# EAGLE design HAP-12xBusverteiler-1.0 (EAGLE 6.4)
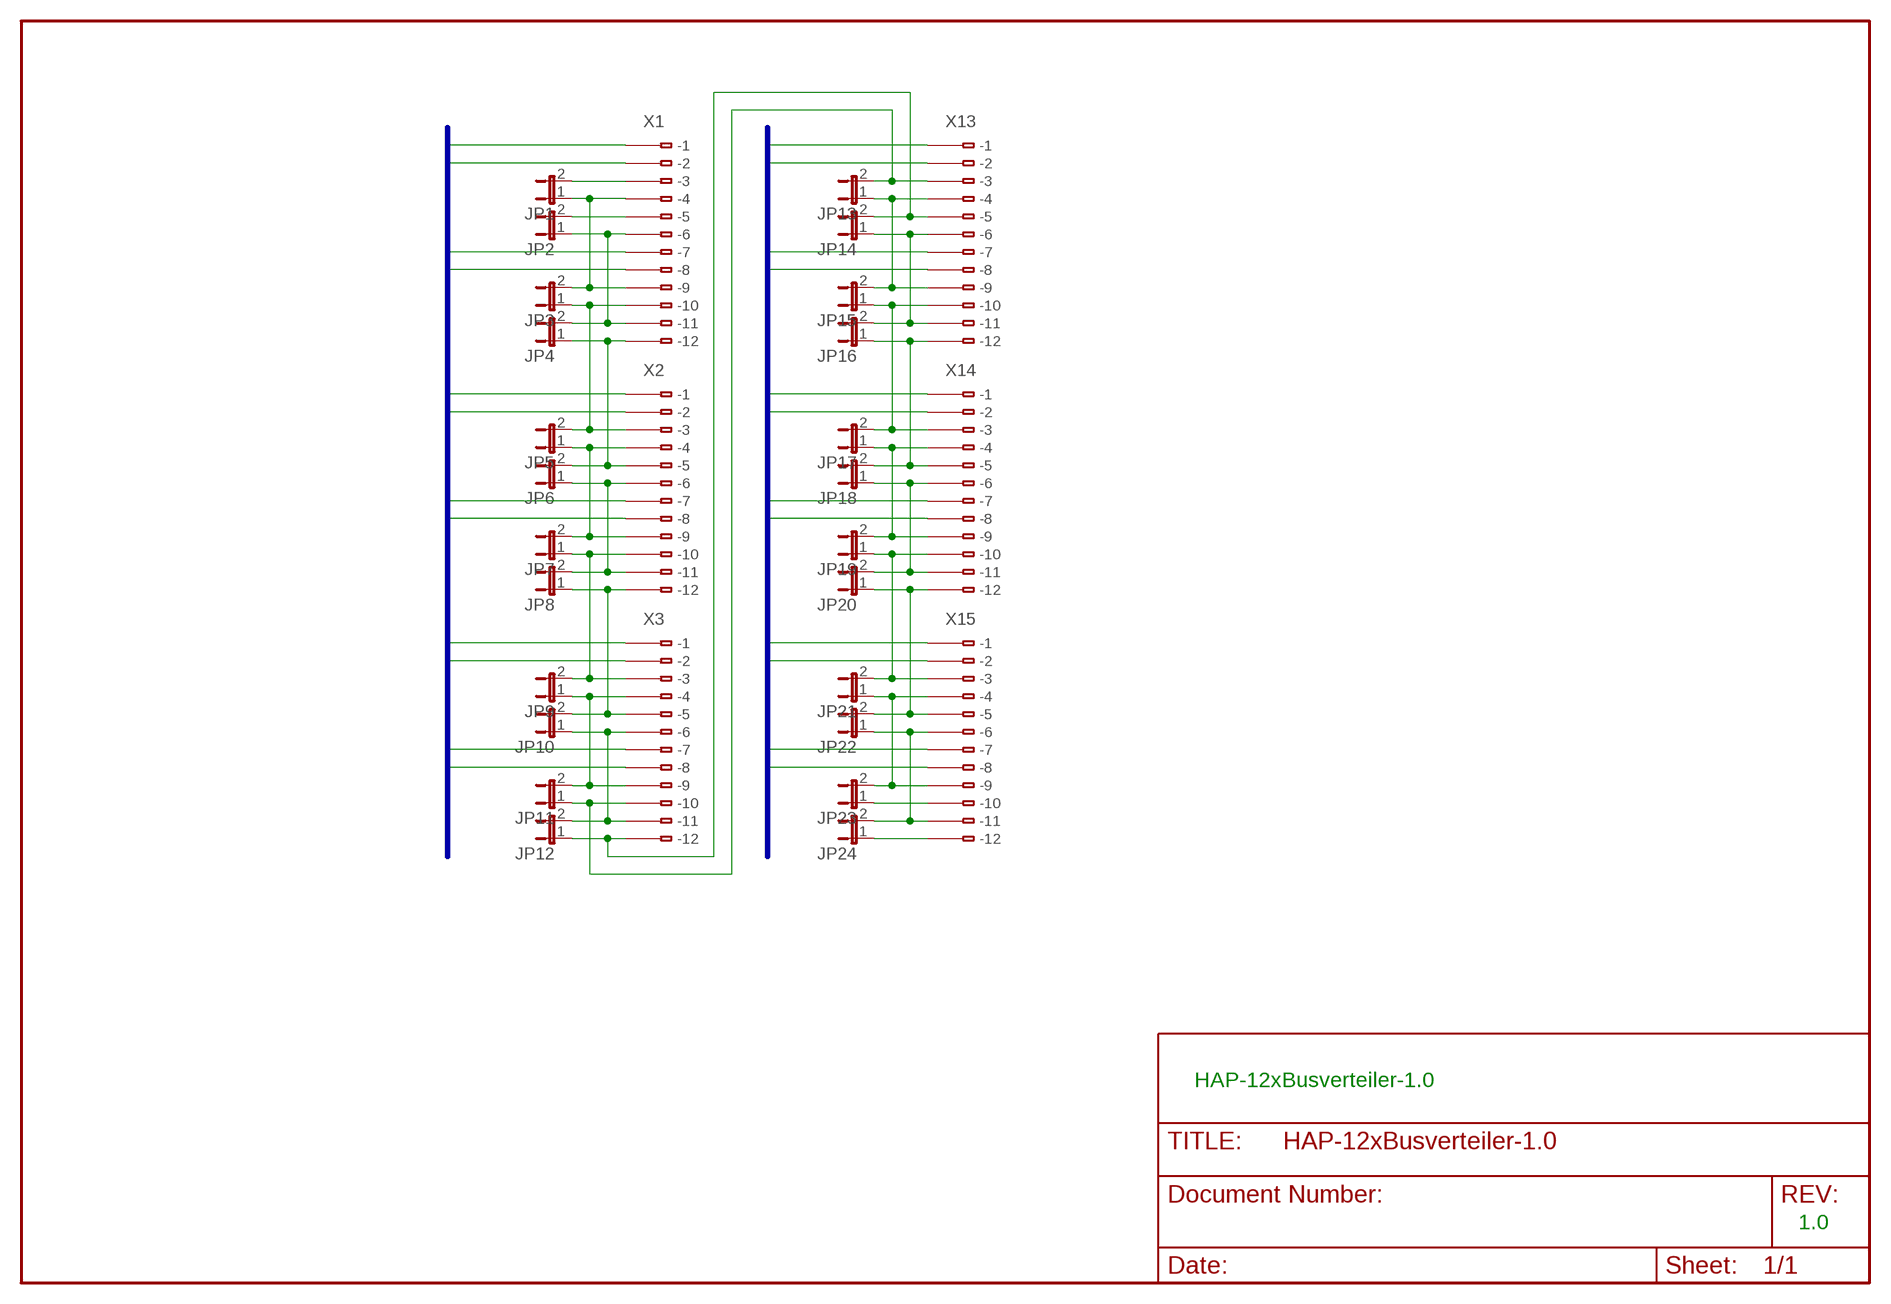
[diagram p0: schematic, sheet 1]

## Parts
JP1  JP1E  [JP1]
JP2  JP1E  [JP1]
JP3  JP1E  [JP1]
JP4  JP1E  [JP1]
JP5  JP1E  [JP1]
JP6  JP1E  [JP1]
JP7  JP1E  [JP1]
JP8  JP1E  [JP1]
JP9  JP1E  [JP1]
JP10  JP1E  [JP1]
JP11  JP1E  [JP1]
JP12  JP1E  [JP1]
JP13  JP1E  [JP1]
JP14  JP1E  [JP1]
JP15  JP1E  [JP1]
JP16  JP1E  [JP1]
JP17  JP1E  [JP1]
JP18  JP1E  [JP1]
JP19  JP1E  [JP1]
JP20  JP1E  [JP1]
JP21  JP1E  [JP1]
JP22  JP1E  [JP1]
JP23  JP1E  [JP1]
JP24  JP1E  [JP1]
X1  233-512  [233-512]
X2  233-512  [233-512]
X3  233-512  [233-512]
X13  233-512  [233-512]
X14  233-512  [233-512]
X15  233-512  [233-512]

## Nets
12V [12V]: X1.B1(B-1) X1.B7(B-7) X2.B1(B-1) X2.B7(B-7) X3.B1(B-1) X3.B7(B-7) X13.B1(B-1) X13.B7(B-7) X14.B1(B-1) X14.B7(B-7) X15.B1(B-1) X15.B7(B-7)
GND [GND]: X1.B2(B-2) X1.B8(B-8) X2.B2(B-2) X2.B8(B-8) X3.B2(B-2) X3.B8(B-8) X13.B2(B-2) X13.B8(B-8) X14.B2(B-2) X14.B8(B-8) X15.B2(B-2) X15.B8(B-8)
N$1: JP1.1 JP3.2 X1.B4(B-4) X1.B9(B-9)
N$2: JP3.1 JP5.2 X1.B10(B-10) X2.B3(B-3)
N$4: JP5.1 JP7.2 X2.B4(B-4) X2.B9(B-9)
N$5: JP13.1 JP15.2 X13.B4(B-4) X13.B9(B-9)
N$7: JP14.1 JP16.2 X13.B6(B-6) X13.B11(B-11)
N$9: JP15.1 JP17.2 X13.B10(B-10) X14.B3(B-3)
N$11: JP16.1 JP18.2 X13.B12(B-12) X14.B5(B-5)
N$12: JP2.1 JP4.2 X1.B6(B-6) X1.B11(B-11)
N$13: JP4.1 JP6.2 X1.B12(B-12) X2.B5(B-5)
N$14: JP6.1 JP8.2 X2.B6(B-6) X2.B11(B-11)
N$16: JP7.1 JP9.2 X2.B10(B-10) X3.B3(B-3)
N$17: JP17.1 JP19.2 X14.B4(B-4) X14.B9(B-9)
N$19: JP18.1 JP20.2 X14.B6(B-6) X14.B11(B-11)
N$21: JP19.1 JP21.2 X14.B10(B-10) X15.B3(B-3)
N$23: JP1.2 X1.B3(B-3)
N$24: JP2.2 X1.B5(B-5)
N$25: JP20.1 JP22.2 X14.B12(B-12) X15.B5(B-5)
N$27: JP21.1 JP23.2 X15.B4(B-4) X15.B9(B-9)
N$28: JP8.1 JP10.2 X2.B12(B-12) X3.B5(B-5)
N$30: JP9.1 JP11.2 X3.B4(B-4) X3.B9(B-9)
N$31: JP22.1 JP24.2 X15.B6(B-6) X15.B11(B-11)
N$32: JP10.1 JP12.2 X3.B6(B-6) X3.B11(B-11)
N$34: JP11.1 JP13.2 X3.B10(B-10) X13.B3(B-3)
N$35: JP23.1 X15.B10(B-10)
N$36: JP12.1 JP14.2 X3.B12(B-12) X13.B5(B-5)
N$38: JP24.1 X15.B12(B-12)
Unconnected: X1.A1(-1) X1.A2(-2) X1.A3(-3) X1.A4(-4) X1.A5(-5) X1.A6(-6) X1.A7(-7) X1.A8(-8) X1.A9(-9) X1.A10(-10) X1.A11(-11) X1.A12(-12) X2.A1(-1) X2.A2(-2) X2.A3(-3) X2.A4(-4) X2.A5(-5) X2.A6(-6) X2.A7(-7) X2.A8(-8) X2.A9(-9) X2.A10(-10) X2.A11(-11) X2.A12(-12) X3.A1(-1) X3.A2(-2) X3.A3(-3) X3.A4(-4) X3.A5(-5) X3.A6(-6) X3.A7(-7) X3.A8(-8) X3.A9(-9) X3.A10(-10) X3.A11(-11) X3.A12(-12) X13.A1(-1) X13.A2(-2) X13.A3(-3) X13.A4(-4) X13.A5(-5) X13.A6(-6) X13.A7(-7) X13.A8(-8) X13.A9(-9) X13.A10(-10) X13.A11(-11) X13.A12(-12) X14.A1(-1) X14.A2(-2) X14.A3(-3) X14.A4(-4) X14.A5(-5) X14.A6(-6) X14.A7(-7) X14.A8(-8) X14.A9(-9) X14.A10(-10) X14.A11(-11) X14.A12(-12) X15.A1(-1) X15.A2(-2) X15.A3(-3) X15.A4(-4) X15.A5(-5) X15.A6(-6) X15.A7(-7) X15.A8(-8) X15.A9(-9) X15.A10(-10) X15.A11(-11) X15.A12(-12)

## Buses
GND,12V,H,HB,L,LB

## Notes on the sheet
- HAP-12xBusverteiler-1.0
- 1.0

## Library data of the parts
JP1-JP24 = jumper:JP1E: JUMPER
X1-X3 X13-X15 = con-wago:233-512: WAGO Cage Clamp; MF: Wago Corporation; MPN: 0233-0512; OC_FARNELL: 1777102; OC_NEWARK: 79K2055

## Net classes
0 default: width 0.406 mm, clearance 0.102 mm
1 12V: width 0.813 mm, clearance 0.254 mm
2 GND: width 0.813 mm, clearance 0.254 mm

## Board
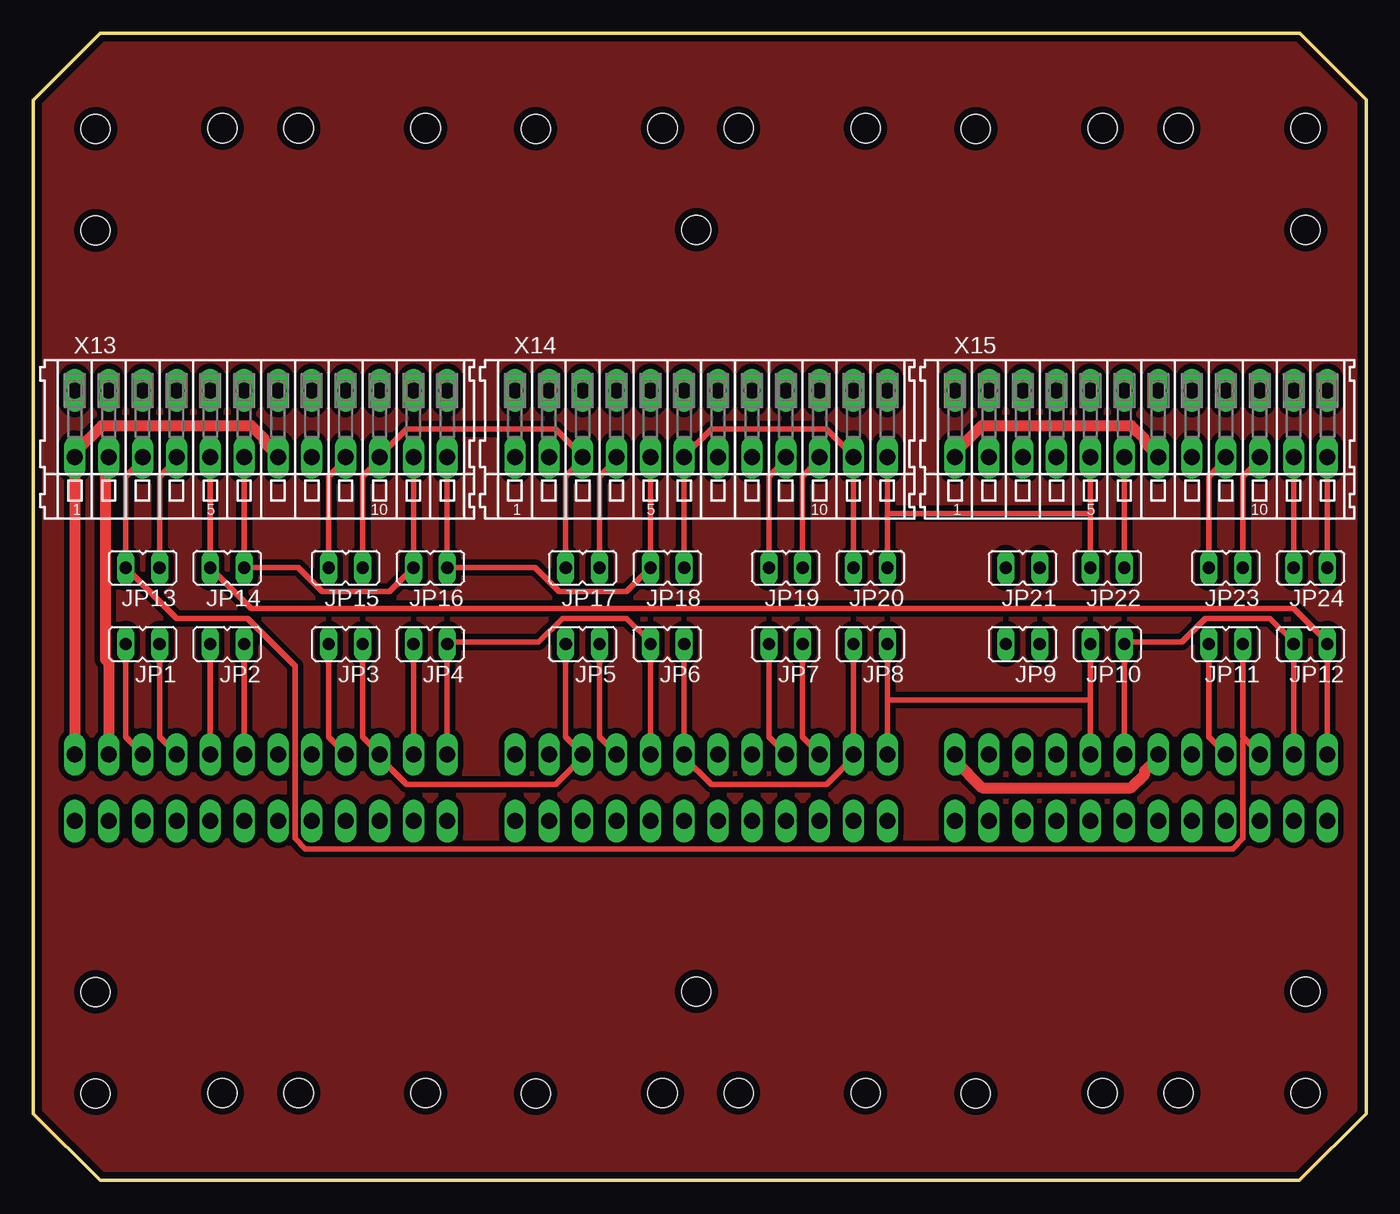
[diagram p1: board, top side]
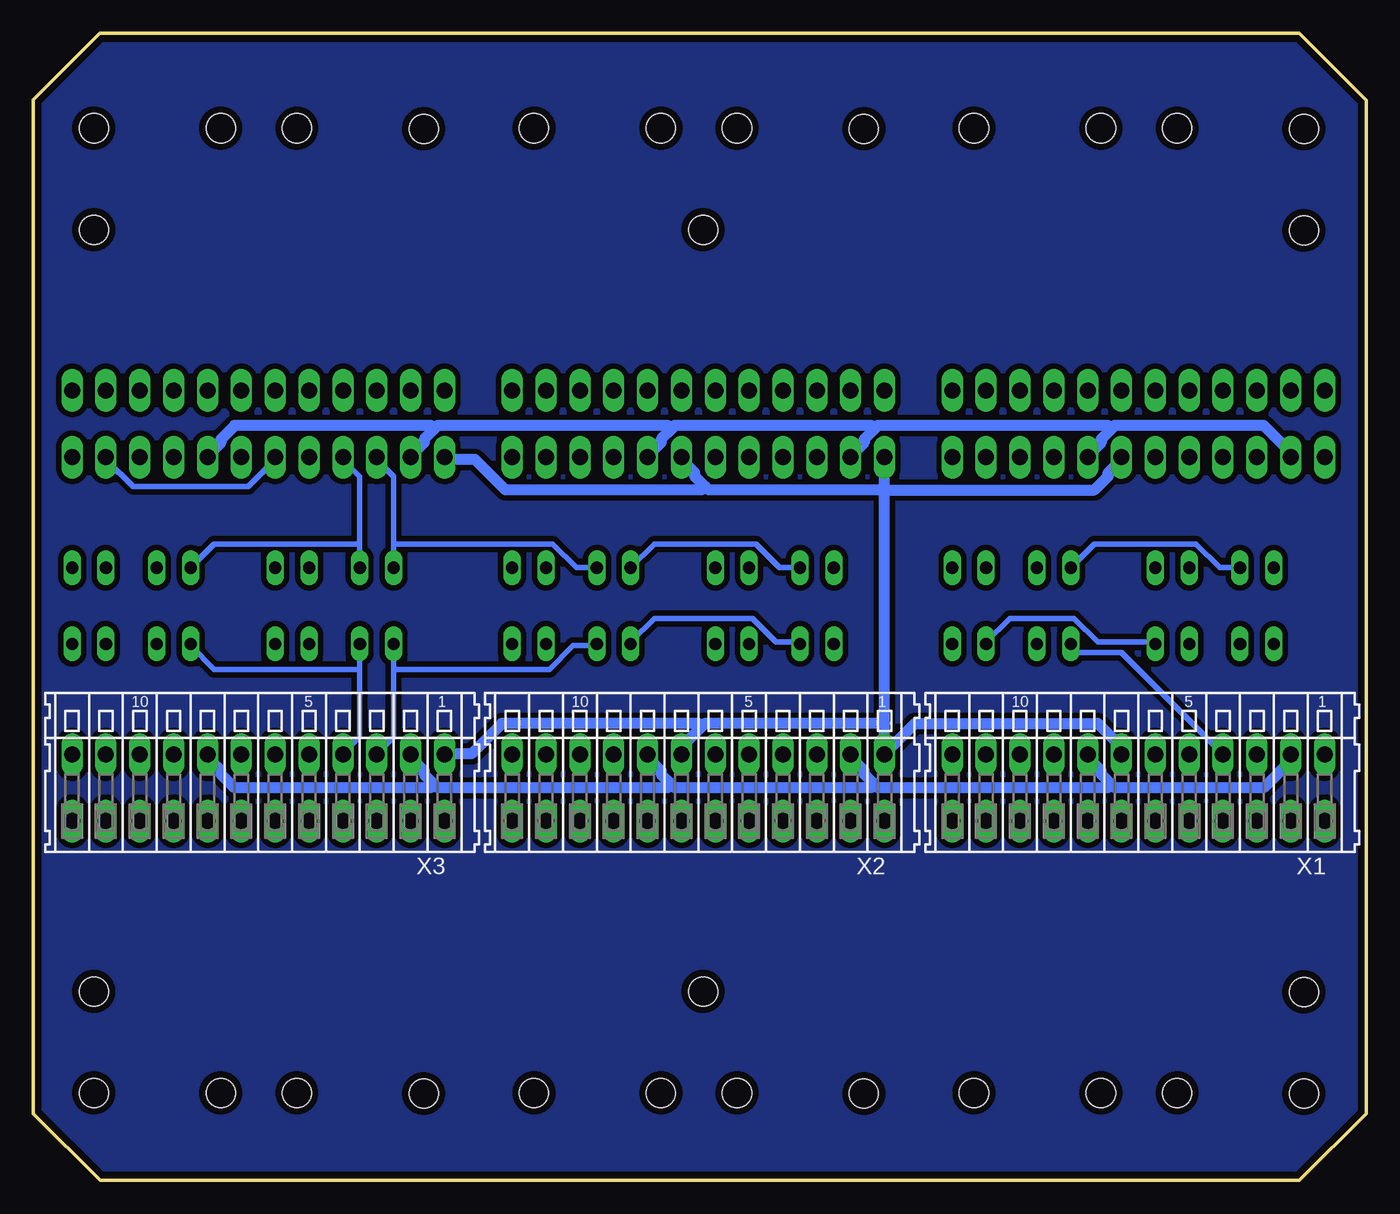
[diagram p2: board, bottom side, seen from below]

Size 100.01 x 86.08 mm. Coordinates in mm from the lower left corner, seen from the top.
Outline: 100.01,5.01 100.01,81.08 95.01,86.08 5.01,86.08 0,81.07 0.01,5 5.01,0 95,0 100,5
Copper layers (1*16): Top 0.035mm / dielectric 1.5mm / Bottom 0.035mm
Design rules "leiton": minimum track width 6mil, minimum drill 0.3mm, track to track 6mil, track to pad 6mil, pad to pad 6mil, via to via 6mil, smd to smd 6mil, copper to edge 20mil, drill to drill 8mil, minimum pad ring 8mil, minimum via ring 6mil, stop-mask expansion 3mil, vias tented up to drill 0mil, thermal gap 8mil
Holes 2.2 mm at 4.67,78.91 14.19,78.96 19.9,78.96 29.43,78.96 37.7,78.91 47.21,78.96 52.92,78.96 62.45,78.96 70.72,78.91 80.23,78.96 85.95,78.96 95.47,78.96 4.67,6.53 14.19,6.57 19.9,6.57 29.43,6.57 37.7,6.53 47.21,6.57 52.92,6.57 62.45,6.57 70.72,6.53 80.23,6.57 85.95,6.57 95.47,6.57 4.67,71.29 4.67,14.14 95.47,71.34 95.47,14.19 49.75,14.19 49.75,71.34

### Footprints (pad centres in the part's own frame; a part is rotated, then mirrored left to right if it is on the bottom)
JP1 = drill 0.914 long: 1 0,-1.27; 2 0,1.27
233-512 = drill 1.2 long: A1 -13.97,2.5; A2 -11.43,2.5; A3 -8.89,2.5; A4 -6.35,2.5; A5 -3.81,2.5; A6 -1.27,2.5; A7 1.27,2.5; A8 3.81,2.5; A9 6.35,2.5; A10 8.89,2.5; A11 11.43,2.5; A12 13.97,2.5; B1 -13.97,-2.5; B2 -11.43,-2.5; B3 -8.89,-2.5; B4 -6.35,-2.5; B5 -3.81,-2.5; B6 -1.27,-2.5; B7 1.27,-2.5; B8 3.81,-2.5; B9 6.35,-2.5; B10 8.89,-2.5; B11 11.43,-2.5; B12 13.97,-2.5

### Placement (x,y rotation side)
JP1  8.2,40.27 90 top
JP2  14.55,40.27 90 top
JP3  23.44,40.27 90 top
JP4  29.79,40.27 90 top
JP5  41.22,40.27 90 top
JP6  47.57,40.27 90 top
JP7  56.46,40.27 90 top
JP8  62.81,40.27 90 top
JP9  74.24,40.27 90 top
JP10  80.59,40.27 90 top
JP11  89.48,40.27 90 top
JP12  95.83,40.27 90 top
JP13  8.2,45.98 90 top
JP14  14.55,45.98 90 top
JP15  23.44,45.98 90 top
JP16  29.79,45.98 90 top
JP17  41.22,45.98 90 top
JP18  47.57,45.98 90 top
JP19  56.46,45.98 90 top
JP20  62.81,45.98 90 top
JP21  74.24,45.98 90 top
JP22  80.59,45.98 90 top
JP23  89.48,45.98 90 top
JP24  95.83,45.98 90 top
X1  17.09,29.47 180 bottom
X2  50.11,29.47 180 bottom
X3  83.13,29.47 180 bottom
X13  17.09,56.77 0 top
X14  50.11,56.77 0 top
X15  83.13,56.77 0 top

### Tracks (layer width: path | path; a pad name or v marks a point on that pad's centre or on a via)
12V
  Top 0.813: X1.B1 3.12,32.01 3.12,54.11 X13.B1 3.12,54.62 5.15,56.65 16.33,56.65 17.34,55.63 17.34,55.38 18.36,54.36 X13.B7 | X3.B7 84.4,31.76 83.38,30.74 83.38,30.49 82.37,29.47 71.19,29.47 69.16,31.5 69.16,31.76 X3.B1 | X15.B7 84.4,54.36 83.38,55.38 83.38,55.63 82.37,56.65 71.19,56.65 69.16,54.62 69.16,54.36 X15.B1
  Bottom 0.813: X1.B7 18.36,32.01 18.36,32.52 20.14,34.3 33.85,34.3 36.14,32.01 X2.B1 36.14,32.52 36.14,34.3 | 36.14,34.3 36.14,51.82 | 36.14,51.82 36.14,54.11 X14.B1 | 49.86,34.04 49.6,34.3 36.39,34.3 36.14,34.3 | 49.86,34.04 51.38,32.52 51.38,32.01 X2.B7 | 49.6,52.08 49.35,51.82 36.39,51.82 36.14,51.82 | 49.6,52.08 50.36,52.84 50.36,53.09 51.38,54.11 X14.B7 | X3.B1 69.16,32.01 67.13,32.01 64.84,34.3 50.11,34.3 49.86,34.04 | X15.B1 69.16,54.11 66.87,54.11 64.59,51.82 49.86,51.82 49.6,52.08 | X13.B7 18.36,54.11 19.38,53.09 19.38,52.84 20.39,51.82 35.89,51.82 36.14,51.82
GND
  Top 0.813: X1.B2 5.66,32.01 5.66,38.87 5.41,39.12 5.41,53.85 5.66,54.11 X13.B2
  Bottom 0.813: 19.12,29.72 18.87,29.47 7.69,29.47 5.66,31.5 5.66,31.76 X1.B2 | 19.12,29.72 19.88,30.49 19.88,30.74 20.9,31.76 X1.B8 | 36.9,29.72 36.65,29.47 19.38,29.47 19.12,29.72 | 36.9,29.72 37.66,30.49 37.66,30.74 38.68,31.76 X2.B2 | 52.14,29.72 51.89,29.47 37.16,29.47 36.9,29.72 | 52.14,29.72 52.9,30.49 52.9,30.74 53.92,31.76 X2.B8 | 69.92,29.72 69.67,29.47 52.4,29.47 52.14,29.72 | 69.92,29.72 70.68,30.49 70.68,30.74 71.7,31.76 X3.B2 | X3.B8 86.94,31.76 85.92,30.74 85.92,30.49 84.91,29.47 70.18,29.47 69.92,29.72 | 19.12,56.39 18.87,56.65 7.69,56.65 5.66,54.62 5.66,54.36 X13.B2 | 19.12,56.39 19.88,55.63 19.88,55.38 20.9,54.36 X13.B8 | 36.9,56.39 36.65,56.65 19.38,56.65 19.12,56.39 | 36.9,56.39 37.66,55.63 37.66,55.38 38.68,54.36 X14.B2 | 52.14,56.39 51.89,56.65 37.16,56.65 36.9,56.39 | 52.14,56.39 52.9,55.63 52.9,55.38 53.92,54.36 X14.B8 | 69.92,56.39 69.67,56.65 52.4,56.65 52.14,56.39 | 69.92,56.39 70.68,55.63 70.68,55.38 71.7,54.36 X15.B2 | X15.B8 86.94,54.36 85.92,55.38 85.92,55.63 84.91,56.65 70.18,56.65 69.92,56.39
N$1
  Top 0.406: JP1.1 9.47,40.14 9.47,33.28 10.74,32.01 X1.B4 | JP3.2 22.17,40.14 22.17,33.28 23.44,32.01 X1.B9
  Bottom 0.406: X1.B4 10.74,32.01 18.36,39.63 21.66,39.63 22.17,40.14 JP3.2
N$2
  Top 0.406: JP3.1 24.71,40.14 24.71,33.28 25.98,32.01 X1.B10 25.98,31.76 28.01,29.72 39.19,29.72 41.22,31.76 X2.B3 41.22,32.01 39.95,33.28 39.95,40.14 JP5.2
N$3
  pour Bottom (isolate 0.406): 5.03,85.99 95.2,85.99 100.28,80.91 100.28,5.34 95.2,0.26 5.03,0.26 -0.05,5.34 -0.05,80.91
N$4
  Top 0.406: JP5.1 42.49,40.14 42.49,33.28 43.76,32.01 X2.B4 | JP7.2 55.19,40.14 55.19,33.28 56.46,32.01 X2.B9
  Bottom 0.406: JP5.1 42.49,40.39 44.27,40.39 46.05,42.17 53.41,42.17 55.19,40.39 JP7.2
N$5
  Top 0.406: JP13.1 9.47,52.84 10.74,54.11 X13.B4 | JP15.2 22.17,52.84 23.44,54.11 X13.B9
  Bottom 0.406: JP13.1 10.99,45.98 12.77,47.76 20.39,47.76 JP15.2
N$6
  pour Top (isolate 0.406): 5.03,85.99 95.2,85.99 100.28,80.91 100.28,5.34 94.56,-0.38 5.66,-0.38 -0.05,5.34 -0.05,80.91
N$7
  Top 0.406: X13.B6 15.82,54.11 JP14.1 19.88,45.98 21.66,44.2 26.74,44.2 JP16.2 28.52,54.11 X13.B11
N$9
  Top 0.406: JP15.1 24.71,52.84 25.98,54.11 X13.B10 25.98,54.36 28.01,56.39 39.19,56.39 41.22,54.36 X14.B3 41.22,54.11 39.95,52.84 JP17.2
N$11
  Top 0.406: X13.B12 31.06,54.11 JP16.1 37.66,45.98 39.44,44.2 44.52,44.2 JP18.2 46.3,54.11 X14.B5
N$12
  Top 0.406: JP2.1 15.82,40.14 15.82,32.01 X1.B6 | JP4.2 28.52,40.14 28.52,32.01 X1.B11
  Bottom 0.406: JP2.1 15.82,40.39 20.14,40.39 21.92,42.17 26.74,42.17 28.52,40.39 JP4.2
N$13
  Top 0.406: X1.B12 31.06,32.01 31.06,40.14 JP4.1 31.06,40.39 37.92,40.39 39.7,42.17 44.52,42.17 46.3,40.39 JP6.2 46.3,40.14 46.3,32.01 X2.B5
N$14
  Top 0.406: JP6.1 48.84,40.14 48.84,32.01 X2.B6 48.84,31.76 50.87,29.72 59.51,29.72 61.54,31.76 X2.B11 61.54,32.01 61.54,40.14 JP8.2
N$16
  Top 0.406: JP7.1 57.73,40.14 57.73,33.28 59,32.01 X2.B10
  Bottom 0.406: 72.97,38.36 72.97,33.28 74.24,32.01 X3.B3 | 72.97,38.36 72.97,40.14 JP9.2 | 72.97,38.36 61.29,38.36 59.51,40.14 57.73,40.14 JP7.1
N$17
  Top 0.406: JP17.1 42.49,52.84 43.76,54.11 X14.B4 | JP19.2 55.19,52.84 56.46,54.11 X14.B9
  Bottom 0.406: JP17.1 44.01,45.98 45.79,47.76 53.41,47.76 JP19.2
N$19
  Top 0.406: JP18.1 48.84,54.11 X14.B6 48.84,54.36 50.87,56.39 59.51,56.39 61.54,54.36 X14.B11 61.54,54.11 JP20.2
N$21
  Top 0.406: JP19.1 57.73,52.84 59,54.11 X14.B10
  Bottom 0.406: 72.97,47.76 72.97,52.84 74.24,54.11 X15.B3 | 72.97,47.76 JP21.2 | JP19.1 59.25,45.98 61.03,47.76 72.97,47.76
N$23
  Top 0.406: JP1.2 6.93,40.14 6.93,33.28 8.2,32.01 X1.B3
N$24
  Top 0.406: JP2.2 13.28,40.14 13.28,32.01 X1.B5
N$25
  Top 0.406: 64.08,50.04 64.08,54.11 X14.B12 | 64.08,50.04 JP20.1 | 79.32,50.04 79.32,54.11 X15.B5 | 79.32,50.04 JP22.2 | 79.32,50.04 64.08,50.04
N$27
  Top 0.406: JP23.2 88.21,52.84 89.48,54.11 X15.B9
  Bottom 0.406: 75.51,47.76 75.51,52.84 76.78,54.11 X15.B4 | 75.51,47.76 JP21.1 | 75.51,47.76 86.43,47.76 JP23.2
N$28
  Top 0.406: 64.08,36.07 64.08,32.01 X2.B12 | 64.08,36.07 64.08,40.14 JP8.1 | 79.32,36.07 79.32,32.01 X3.B5 | 79.32,36.07 79.32,40.14 JP10.2 | 79.32,36.07 64.08,36.07
N$30
  Top 0.406: JP11.2 88.21,40.14 88.21,33.28 89.48,32.01 X3.B9
  Bottom 0.406: 75.51,38.36 75.51,33.28 76.78,32.01 X3.B4 | 75.51,38.36 75.51,40.14 JP9.1 | 75.51,38.36 86.43,38.36 88.21,40.14 JP11.2
N$31
  Top 0.406: JP22.1 81.86,54.11 X15.B6 | JP24.2 94.56,54.11 X15.B11
  Bottom 0.406: X15.B6 81.86,54.11 83.89,52.08 92.53,52.08 94.56,54.11 X15.B11
N$32
  Top 0.406: X3.B6 81.86,32.01 81.86,40.14 JP10.1 81.86,40.39 86.18,40.39 87.96,42.17 92.78,42.17 94.56,40.39 JP12.2 94.56,40.14 94.56,32.01 X3.B11
N$34
  Top 0.406: X13.B3 8.2,54.11 6.93,52.84 JP13.2 10.74,42.17 16.07,42.17 19.63,38.61 19.63,25.66 20.39,24.9 89.99,24.9 90.75,25.66 90.75,33.03 90.88,33.15 | 90.88,33.15 92.02,32.01 X3.B10 | 90.88,33.15 90.75,33.28 90.75,40.14 JP11.1
N$35
  Top 0.406: JP23.1 90.75,52.84 92.02,54.11 X15.B10
N$36
  Top 0.406: X13.B5 13.28,54.11 JP14.2 16.33,42.93 94.56,42.93 97.1,40.39 JP12.1 97.1,40.14 97.1,32.01 X3.B12
N$38
  Top 0.406: JP24.1 97.1,54.11 X15.B12